# Altium project mcu.PrjPCB
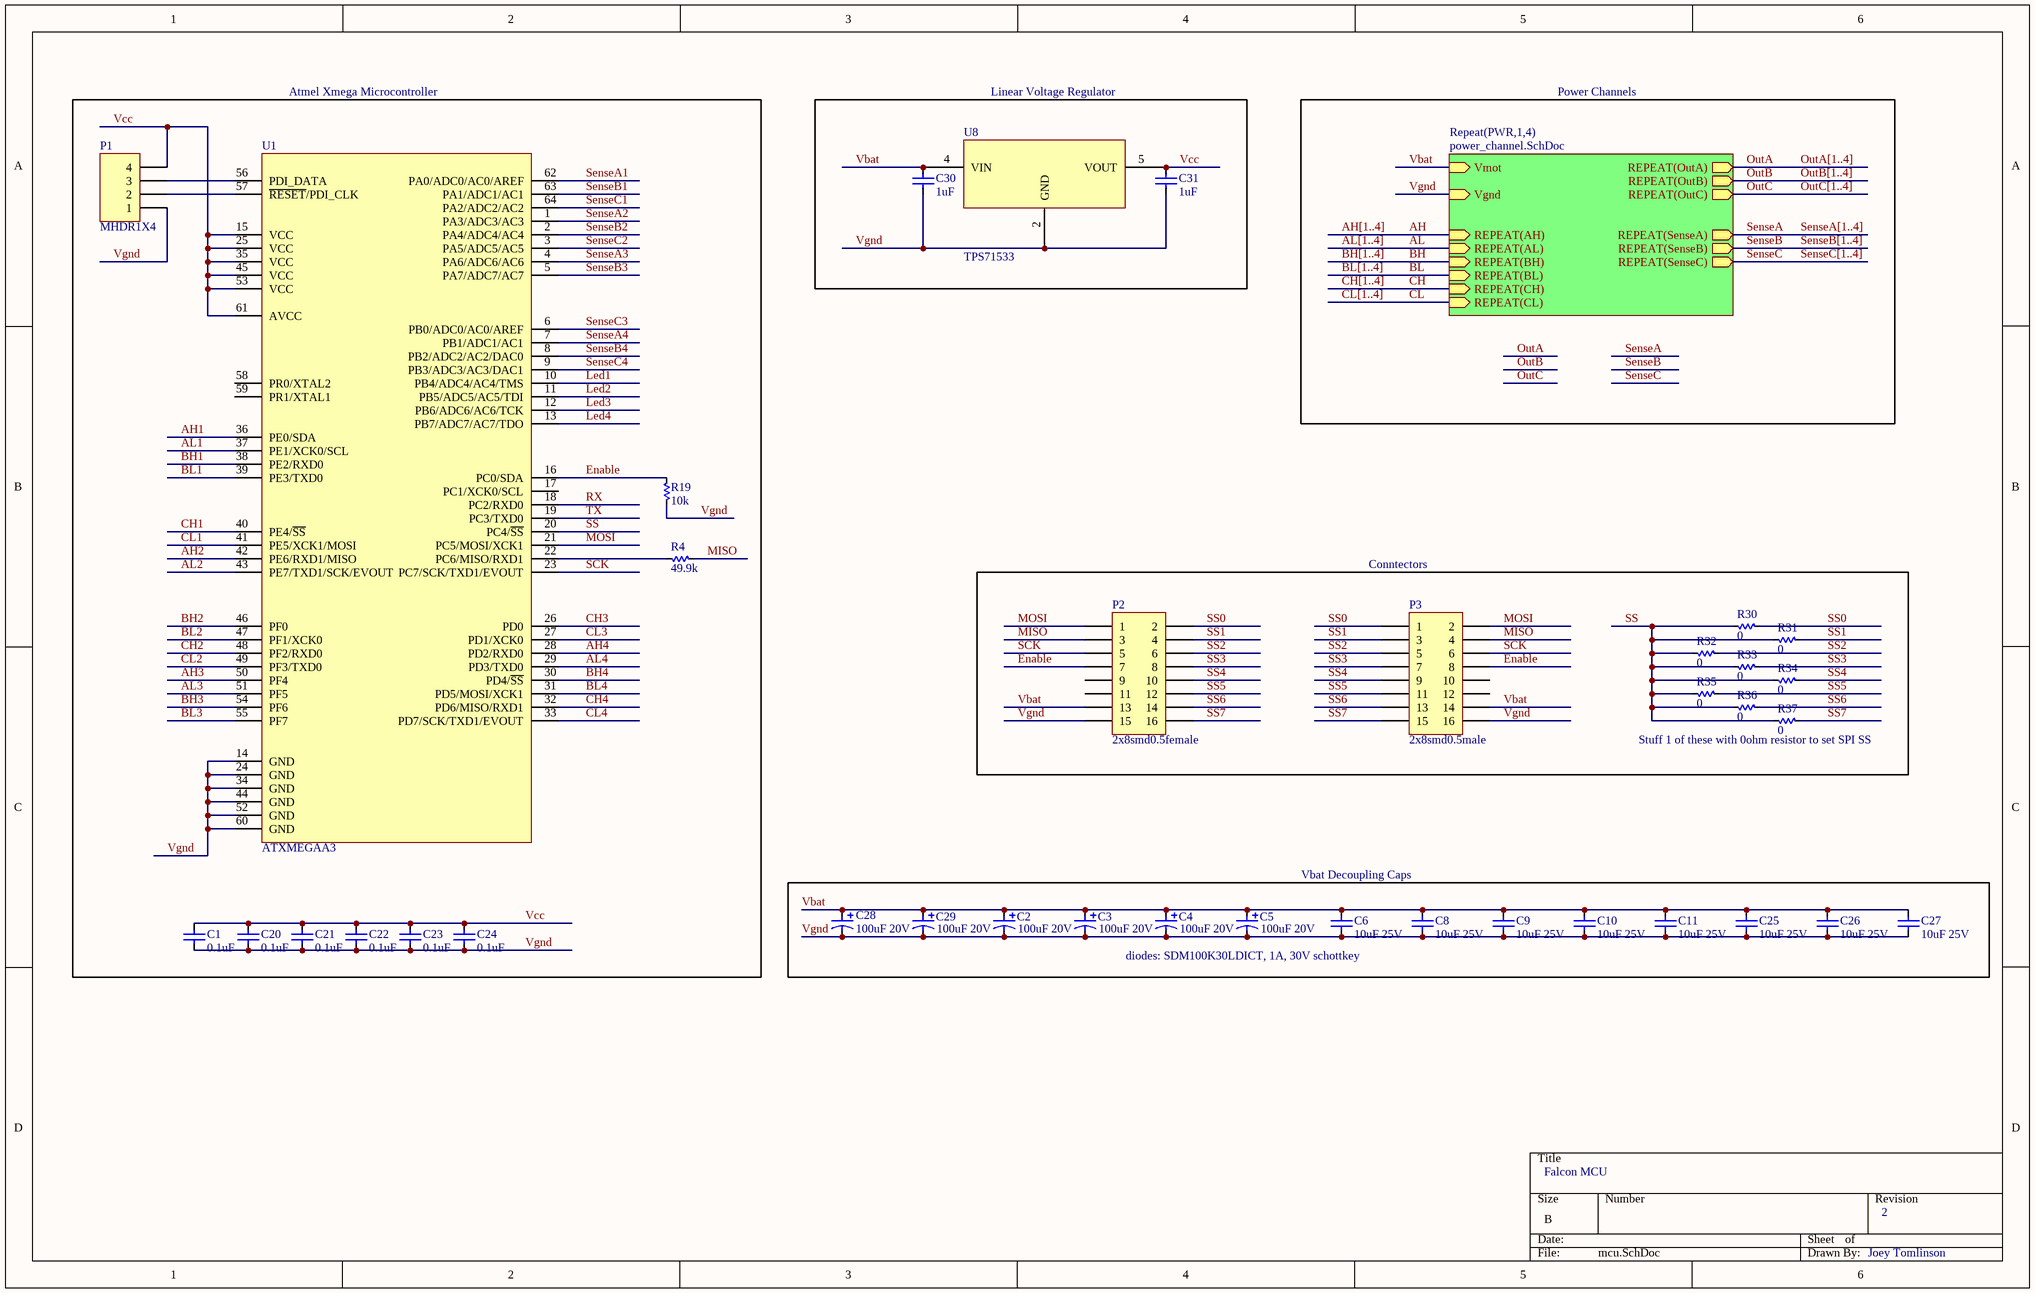
[diagram p0: mcu.SchDoc]
2 sheets, 145 parts. Net scope: hierarchical (ports join the sheet entries above them; power ports are global).
Board file: mcu.PcbDoc
Sheets:
  mcu.SchDoc
    PWR1 = power_channel.SchDoc
    PWR2 = power_channel.SchDoc
    PWR3 = power_channel.SchDoc
    PWR4 = power_channel.SchDoc

## Sheet mcu.SchDoc: Falcon MCU
size B; DrawnBy: Joey Tomlinson; Engineer: Joey Tomlinson; Revision: 2; PageSetup: Record=PageOptions|CenterHorizontal=True|CenterVertical=True|PrintScale=1.54|XCorrection=1.00|YCorrection=1.00|PrintKind=1|BorderSize=5000000|LeftOffset=0|BottomOffset=0|Orientation=2|PaperLength=1000|PaperWidth=1000|Scale=100|PaperSource=7|PrintQuality=-4|MediaType=1|DitherType=10|PaperKind=A2|PrintScaleMode=1

### Parts
C1  value 0.1uF  [0603 (1608)]  (hidden comment: Capacitor)
C2  value 100uF 20V  [7343 (TANT E)]  (hidden comment: Polarized Capacitor)
C3  value 100uF 20V  [7343 (TANT E)]  (hidden comment: Polarized Capacitor)
C4  value 100uF 20V  [7343 (TANT E)]  (hidden comment: Polarized Capacitor)
C5  value 100uF 20V  [7343 (TANT E)]  (hidden comment: Polarized Capacitor)
C6  value 10uF 25V  [0805 (2012)]  (hidden comment: Capacitor)
C8  value 10uF 25V  [0805 (2012)]  (hidden comment: Capacitor)
C9  value 10uF 25V  [0805 (2012)]  (hidden comment: Capacitor)
C10  value 10uF 25V  [0805 (2012)]  (hidden comment: Capacitor)
C11  value 10uF 25V  [0805 (2012)]  (hidden comment: Capacitor)
C20  value 0.1uF  [0603 (1608)]  (hidden comment: Capacitor)
C21  value 0.1uF  [0603 (1608)]  (hidden comment: Capacitor)
C22  value 0.1uF  [0603 (1608)]  (hidden comment: Capacitor)
C23  value 0.1uF  [0603 (1608)]  (hidden comment: Capacitor)
C24  value 0.1uF  [0603 (1608)]  (hidden comment: Capacitor)
C25  value 10uF 25V  [0805 (2012)]  (hidden comment: Capacitor)
C26  value 10uF 25V  [0805 (2012)]  (hidden comment: Capacitor)
C27  value 10uF 25V  [0805 (2012)]  (hidden comment: Capacitor)
C28  value 100uF 20V  [7343 (TANT E)]  (hidden comment: Polarized Capacitor)
C29  value 100uF 20V  [7343 (TANT E)]  (hidden comment: Polarized Capacitor)
C30  value 1uF  [0603 (1608)]  (hidden comment: Capacitor)
C31  value 1uF  [0603 (1608)]  (hidden comment: Capacitor)
P1  MHDR1X4  [MHDR1X4]
P2  2x8smd0.5female  [S9007E-08-ND]
P3  2x8smd0.5male  [S9007E-08-ND]
R4  value 49.9k  [0603 (1608)]  (hidden comment: Resistor)
R19  value 10k  [0603 (1608)]  (hidden comment: Resistor)
R30  value 0  [0603 (1608)]  (hidden comment: Resistor)
R31  value 0  [0603 (1608)]  (hidden comment: Resistor)
R32  value 0  [0603 (1608)]  (hidden comment: Resistor)
R33  value 0  [0603 (1608)]  (hidden comment: Resistor)
R34  value 0  [0603 (1608)]  (hidden comment: Resistor)
R35  value 0  [0603 (1608)]  (hidden comment: Resistor)
R36  value 0  [0603 (1608)]  (hidden comment: Resistor)
R37  value 0  [0603 (1608)]  (hidden comment: Resistor)
U1  ATXMEGAA3  [QFN-64]
U8  TPS71533  [SOT23-5]

### Blocks framed on the sheet
Atmel Xmega Microcontroller: C1 C20-C24 P1 R4 R19 U1
Linear Voltage Regulator: C30 C31 U8

### Sub-sheets
Repeat(PWR,1,4) = power_channel.SchDoc: Vmot (in), REPEAT(AH) (in), REPEAT(AL) (in), REPEAT(BH) (in), REPEAT(BL) (in), REPEAT(CH) (in), REPEAT(CL) (in), REPEAT(OutA) (out), REPEAT(OutB) (out), REPEAT(OutC) (out), REPEAT(SenseA) (out), REPEAT(SenseB) (out), REPEAT(SenseC) (out), Vgnd (in)

### Nets
AH: sheet Repeat(PWR,1,4)/REPEAT(AH)
AH1: U1.36(PE0/SDA)
AH2: U1.42(PE6/RXD1/MISO)
AH3: U1.50(PF4)
AH4: U1.28(PD2/RXD0)
AL: sheet Repeat(PWR,1,4)/REPEAT(AL)
AL1: U1.37(PE1/XCK0/SCL)
AL2: U1.43(PE7/TXD1/SCK/EVOUT)
AL3: U1.51(PF5)
AL4: U1.29(PD3/TXD0)
BH: sheet Repeat(PWR,1,4)/REPEAT(BH)
BH1: U1.38(PE2/RXD0)
BH2: U1.46(PF0)
BH3: U1.54(PF6)
BH4: U1.30(PD4/~{SS})
BL: sheet Repeat(PWR,1,4)/REPEAT(BL)
BL1: U1.39(PE3/TXD0)
BL2: U1.47(PF1/XCK0)
BL3: U1.55(PF7)
BL4: U1.31(PD5/MOSI/XCK1)
CH: sheet Repeat(PWR,1,4)/REPEAT(CH)
CH1: U1.40(PE4/~{SS})
CH2: U1.48(PF2/RXD0)
CH3: U1.26(PD0)
CH4: U1.32(PD6/MISO/RXD1)
CL: sheet Repeat(PWR,1,4)/REPEAT(CL)
CL1: U1.41(PE5/XCK1/MOSI)
CL2: U1.49(PF3/TXD0)
CL3: U1.27(PD1/XCK0)
CL4: U1.33(PD7/SCK/TXD1/EVOUT)
Enable: P2.7 P3.8 R19.2 U1.16(PC0/SDA)
Led1: U1.10(PB4/ADC4/AC4/TMS)
Led2: U1.11(PB5/ADC5/AC5/TDI)
Led3: U1.12(PB6/ADC6/AC6/TCK)
Led4: U1.13(PB7/ADC7/AC7/TDO)
MISO: P2.3 P3.4 R4.1
MOSI: P2.1 P3.2 U1.21(PC5/MOSI/XCK1)
OutA: sheet Repeat(PWR,1,4)/REPEAT(OutA)
OutB: sheet Repeat(PWR,1,4)/REPEAT(OutB)
OutC: sheet Repeat(PWR,1,4)/REPEAT(OutC)
RX: U1.18(PC2/RXD0)
SCK: P2.5 P3.6 U1.23(PC7/SCK/TXD1/EVOUT)
SenseA: sheet Repeat(PWR,1,4)/REPEAT(SenseA)
SenseA1: U1.62(PA0/ADC0/AC0/AREF)  [project net SenseA]
SenseA2: U1.1(PA3/ADC3/AC3)  [project net SenseA]
SenseA3: U1.4(PA6/ADC6/AC6)  [project net SenseA]
SenseA4: U1.7(PB1/ADC1/AC1)  [project net SenseA]
SenseB: sheet Repeat(PWR,1,4)/REPEAT(SenseB)
SenseB1: U1.63(PA1/ADC1/AC1)  [project net SenseB]
SenseB2: U1.2(PA4/ADC4/AC4)  [project net SenseB]
SenseB3: U1.5(PA7/ADC7/AC7)  [project net SenseB]
SenseB4: U1.8(PB2/ADC2/AC2/DAC0)  [project net SenseB]
SenseC: sheet Repeat(PWR,1,4)/REPEAT(SenseC)
SenseC1: U1.64(PA2/ADC2/AC2)  [project net SenseC]
SenseC2: U1.3(PA5/ADC5/AC5)  [project net SenseC]
SenseC3: U1.6(PB0/ADC0/AC0/AREF)  [project net SenseC]
SenseC4: U1.9(PB3/ADC3/AC3/DAC1)  [project net SenseC]
SS: R30.1 R31.1 R32.1 R33.1 R34.1 R35.1 R36.1 R37.1 U1.20(PC4/~{SS})
SS0: P2.2 P3.1 R30.2
SS1: P2.4 P3.3 R31.2
SS2: P2.6 P3.5 R32.2
SS3: P2.8 P3.7 R33.2
SS4: P2.10 P3.9 R34.2
SS5: P2.12 P3.11 R35.2
SS6: P2.14 P3.13 R36.2
SS7: P2.16 P3.15 R37.2
TX: U1.19(PC3/TXD0)
Vbat: C2.1 C3.1 C4.1 C5.1 C6.1 C8.1 C9.1 C10.1 C11.1 C25.1 C26.1 C27.1 C28.1 C29.1 C30.1 P2.13 P3.14 U8.4(VIN) ; sheet Repeat(PWR,1,4)/Vmot
Vcc: C1.1 C20.1 C21.1 C22.1 C23.1 C24.1 C31.1 P1.4 U1.15(VCC) U1.25(VCC) U1.35(VCC) U1.45(VCC) U1.53(VCC) U1.61(AVCC) U8.5(VOUT)
Vgnd: C1.2 C2.2 C3.2 C4.2 C5.2 C6.2 C8.2 C9.2 C10.2 C11.2 C20.2 C21.2 C22.2 C23.2 C24.2 C25.2 C26.2 C27.2 C28.2 C29.2 C30.2 C31.2 P1.1 P2.15 P3.16 R19.1 U1.14(GND) U1.24(GND) U1.34(GND) U1.44(GND) U1.52(GND) U1.60(GND) U8.2(GND) ; sheet Repeat(PWR,1,4)/Vgnd
NetP1_2: P1.2 U1.57(~{RESET}/PDI_CLK)
NetP1_3: P1.3 U1.56(PDI_DATA)
NetR4_2: R4.2 U1.22(PC6/MISO/RXD1)

Not connected (* = marked no-connect by the designer): P2 9 11; P3 10 12; U1 17(PC1/XCK0/SCL) 58(PR0/XTAL2) 59(PR1/XTAL1)

### Buses and harness runs
bus AH[1..4]
bus AL[1..4]
bus BH[1..4]
bus BL[1..4]
bus CH[1..4]
bus CL[1..4]
bus OutA[1..4]
bus OutB[1..4]
bus OutC[1..4]
bus SenseA[1..4]
bus SenseB[1..4]
bus SenseC[1..4]

### Notes on the sheet
- Power Channels
- Conntectors
- (near R37) Stuff 1 of these with 0ohm resistor to set SPI SS
- Vbat Decoupling Caps
- diodes: SDM100K30LDICT, 1A, 30V schottkey

### Library data of the parts
C1 C20-C24 = Capacitor: Part No.: 490-1524-1-ND; Vendor: Digikey; Price Est.: 0.019
C2-C5 C28 C29 = Polarized Capacitor: Part No.: 718-1370-1-ND; Vendor: Digikey
C6 C8-C11 C25-C27 = Capacitor: Part No.: 490-5523-1-ND; Vendor: Digikey; Price Est.: $0.10
C30 C31 = Capacitor: Part No.: 445-3452-1-ND; Vendor: Digikey; Price Est.: 0.061
P1 = MHDR1X4: Header, 4-Pin; Part No.: Not Stuffed; LatestRevisionDate: 17-Jul-2002; LatestRevisionNote: Re-released for DXP Platform.; Publisher: Altium Limited
P2 = 2x8smd0.5female: Vendor: Digikey; Part No.: S9007E-08-ND; Price Est.: 1.43
P3 = 2x8smd0.5male: Part No.: S9013E-08-ND; Vendor: Digikey; Price Est.: 1.43
R4 = Resistor: Part No.: P49.9HCT-ND; Vendor: Digikey; Price Est.: 0.02
R19 = Resistor: Part No.: RMCF0603JT10K0CT-ND; Vendor: Digikey; Price Est.: 0.02
R30-R37 = Resistor: Part No.: RMCF0603ZT0R00CT-ND; Vendor: Digikey; Price Est.: 0.02
U1 = ATXMEGAA3: Manufacturer: Atmel; Part No.: ATXMEGA128A3-MH-ND; Vendor: Digikey; Price Est.: 10.43
U8 = TPS71533: Part No.: 296-12008-1-ND; Vendor: Digikey; Price Est.: 1.29

## Sheet power_channel.SchDoc: Falcon MCU Power Channel
size A; DrawnBy: Joey Tomlinson; Engineer: Joey Tomlinson; Revision: 2
Used 4 times, as channels PWR1, PWR2, PWR3, PWR4. Parts and nets are listed once, with the designators drawn on the sheet.
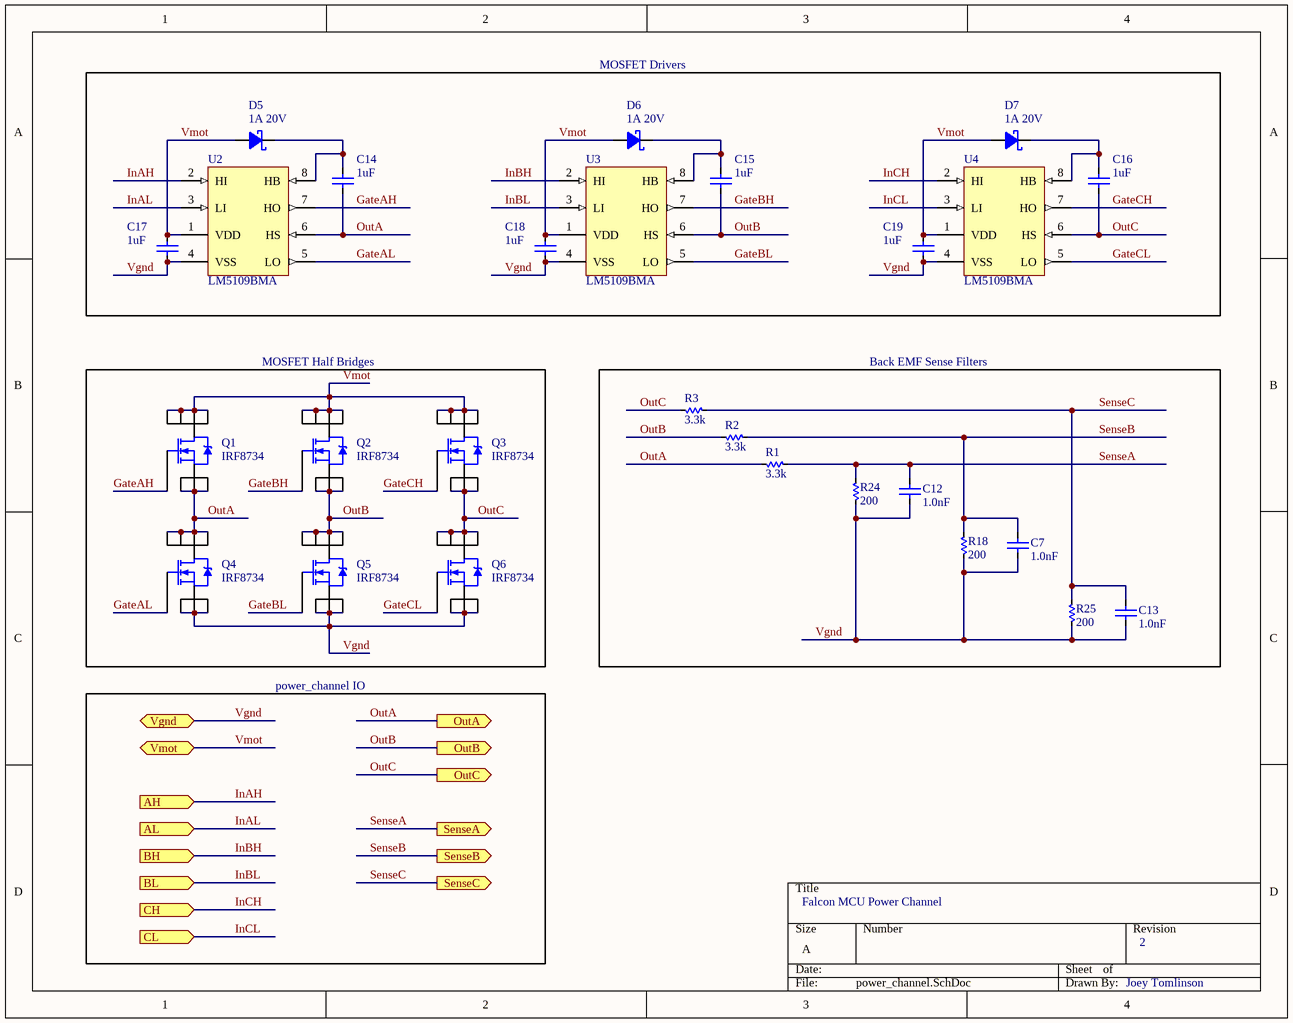
[diagram p1: power_channel.SchDoc]

### Parts
C7  value 1.0nF  [0603 (1608)]  (hidden comment: Capacitor)
C12  value 1.0nF  [0603 (1608)]  (hidden comment: Capacitor)
C13  value 1.0nF  [0603 (1608)]  (hidden comment: Capacitor)
C14  value 1uF  [0603 (1608)]  (hidden comment: Capacitor)
C15  value 1uF  [0603 (1608)]  (hidden comment: Capacitor)
C16  value 1uF  [0603 (1608)]  (hidden comment: Capacitor)
C17  value 1uF  [0603 (1608)]  (hidden comment: Capacitor)
C18  value 1uF  [0603 (1608)]  (hidden comment: Capacitor)
C19  value 1uF  [0603 (1608)]  (hidden comment: Capacitor)
D5  value 1A 20V  [SOD-323]  (hidden comment: Schottky Diode)
D6  value 1A 20V  [SOD-323]  (hidden comment: Schottky Diode)
D7  value 1A 20V  [SOD-323]  (hidden comment: Schottky Diode)
Q1  IRF8734  [SO8]
Q2  IRF8734  [SO8]
Q3  IRF8734  [SO8]
Q4  IRF8734  [SO8]
Q5  IRF8734  [SO8]
Q6  IRF8734  [SO8]
R1  value 3.3k  [0603 (1608)]  (hidden comment: Resistor)
R2  value 3.3k  [0603 (1608)]  (hidden comment: Resistor)
R3  value 3.3k  [0603 (1608)]  (hidden comment: Resistor)
R18  value 200  [0603 (1608)]  (hidden comment: Resistor)
R24  value 200  [0603 (1608)]  (hidden comment: Resistor)
R25  value 200  [0603 (1608)]  (hidden comment: Resistor)
U2  LM5109BMA  [M08A_N]
U3  LM5109BMA  [M08A_N]
U4  LM5109BMA  [M08A_N]

### Blocks framed on the sheet
MOSFET Drivers: C14-C19 D5-D7 U2-U4
MOSFET Half Bridges: Q1-Q6
Back EMF Sense Filters: C7 C12 C13 R1-R3 R18 R24 R25

### Ports
AH (in), AL (in), BH (in), BL (in), CH (in), CL (in), OutA (out), OutB (out), OutC (out), SenseA (out), SenseB (out), SenseC (out), Vgnd, Vmot

### Nets
GateAH: Q1.4(G) U2.7(HO)
GateAL: Q4.4(G) U2.5(LO)
GateBH: Q2.4(G) U3.7(HO)
GateBL: Q5.4(G) U3.5(LO)
GateCH: Q3.4(G) U4.7(HO)
GateCL: Q6.4(G) U4.5(LO)
InAH: U2.2(HI) ; port AH
InAL: U2.3(LI) ; port AL
InBH: U3.2(HI) ; port BH
InBL: U3.3(LI) ; port BL
InCH: U4.2(HI) ; port CH
InCL: U4.3(LI) ; port CL
OutA: C14.2 Q1.1(S) Q1.2(S) Q1.3(S) Q4.5(D) Q4.6(D) Q4.7(D) Q4.8(D) R1.2 U2.6(HS) ; port OutA
OutB: C15.2 Q2.1(S) Q2.2(S) Q2.3(S) Q5.5(D) Q5.6(D) Q5.7(D) Q5.8(D) R2.2 U3.6(HS) ; port OutB
OutC: C16.2 Q3.1(S) Q3.2(S) Q3.3(S) Q6.5(D) Q6.6(D) Q6.7(D) Q6.8(D) R3.2 U4.6(HS) ; port OutC
SenseA: C12.1 R1.1 R24.1 ; port SenseA
SenseB: C7.1 R2.1 R18.1 ; port SenseB
SenseC: C13.1 R3.1 R25.1 ; port SenseC
Vgnd: C7.2 C12.2 C13.2 C17.2 C18.2 C19.2 Q4.1(S) Q4.2(S) Q4.3(S) Q5.1(S) Q5.2(S) Q5.3(S) Q6.1(S) Q6.2(S) Q6.3(S) R18.2 R24.2 R25.2 U2.4(VSS) U3.4(VSS) U4.4(VSS) ; port Vgnd
Vmot: C17.1 C18.1 C19.1 D5.1 D6.1 D7.1 Q1.5(D) Q1.6(D) Q1.7(D) Q1.8(D) Q2.5(D) Q2.6(D) Q2.7(D) Q2.8(D) Q3.5(D) Q3.6(D) Q3.7(D) Q3.8(D) U2.1(VDD) U3.1(VDD) U4.1(VDD) ; port Vmot
NetC14_1: C14.1 D5.2 U2.8(HB)
NetC15_1: C15.1 D6.2 U3.8(HB)
NetC16_1: C16.1 D7.2 U4.8(HB)

### Channels
PWR1: designators end in _PWR1; ports AH=AH1 AL=AL1 BH=BH1 BL=BL1 CH=CH1 CL=CL1 OutA=OutA_PWR1 OutB=OutB_PWR1 OutC=OutC_PWR1 SenseA=SenseA SenseB=SenseB SenseC=SenseC Vgnd=Vgnd Vmot=Vbat
PWR2: designators end in _PWR2; ports AH=AH2 AL=AL2 BH=BH2 BL=BL2 CH=CH2 CL=CL2 OutA=OutA_PWR2 OutB=OutB_PWR2 OutC=OutC_PWR2 SenseA=SenseA SenseB=SenseB SenseC=SenseC Vgnd=Vgnd Vmot=Vbat
PWR3: designators end in _PWR3; ports AH=AH3 AL=AL3 BH=BH3 BL=BL3 CH=CH3 CL=CL3 OutA=OutA_PWR3 OutB=OutB_PWR3 OutC=OutC_PWR3 SenseA=SenseA SenseB=SenseB SenseC=SenseC Vgnd=Vgnd Vmot=Vbat
PWR4: designators end in _PWR4; ports AH=AH4 AL=AL4 BH=BH4 BL=BL4 CH=CH4 CL=CL4 OutA=OutA_PWR4 OutB=OutB_PWR4 OutC=OutC_PWR4 SenseA=SenseA SenseB=SenseB SenseC=SenseC Vgnd=Vgnd Vmot=Vbat

### Notes on the sheet
- power_channel IO

### Library data of the parts
C7 C12 C13 = Capacitor: Part No.: CC0603JRNPO8BN102; Vendor: Digikey; Price Est.: $0.10
C14-C19 = Capacitor: Part No.: 445-3452-1-ND; Vendor: Digikey; Price Est.: 0.061
D5-D7 = Schottky Diode: Part No.: SDM100K30LDICT-ND; Vendor: Digikey; Price Est.: 0.54
Q1-Q6 = IRF8734: Part No.: IRF8734TRPBFCT-ND; Vendor: Digikey; Price Est.: 1.04
R1-R3 = Resistor: Part No.: RMCF0603JT3K30; Vendor: Digikey; Price Est.: 0.02
R18 R24 R25 = Resistor: Part No.: RMCF0603JT200R; Part No. Ref: CRCW[PACKAGE][VALUE]; Vendor: Digikey; Price Est.: 0.02
U2-U4 = LM5109BMA: High Voltage 1A Peak Half Bridge Gate Driver; Manufacturer: National Semiconductor; Part No.: LM5109BMA-ND; CompType: MiscPower; PackageTopMarking: NSZXTT*L5109*BMA; PowerWise: N; Vendor: Digikey; FirstPublished: 4-Dec-2008; DatasheetVersion: Feb-2007; PackageVersion: revL, Sep-2006; PackageReference: M08A; Publisher: Altium Limited; PackageDescription: SOIC Narrow, 4.9 x 3.9 x 1.45mm, 8 Lead, 1.27mm Pitch; PartNumber: LM5109BMA; RoHS: Y; PinCount: 8; DigiKeyPartNumber: LM5109BMA-ND; Code_JEDEC: MS-012-AA; Code_IPC: SOIC127P600-8; ComponentLink1Description: LM5109B Datasheet; ComponentLink1URL: http://www.national.com/ds/LM/LM5109B.pdf; ComponentLink2Description: LM5109B Web Page; ComponentLink2URL: http://www.national.com/pf/LM/LM5109B.html; ComponentLink3Description: M08A Package Page; ComponentLink3URL: http://www.national.com/packaging/folders/m08a.html; Price Est.: 1.70

## Nets that join several sheets
AH1: mcu (U1.36), PWR1 (U2_PWR1.2)
AH2: mcu (U1.42), PWR2 (U2_PWR2.2)
AH3: mcu (U1.50), PWR3 (U2_PWR3.2)
AH4: mcu (U1.28), PWR4 (U2_PWR4.2)
AL1: mcu (U1.37), PWR1 (U2_PWR1.3)
AL2: mcu (U1.43), PWR2 (U2_PWR2.3)
AL3: mcu (U1.51), PWR3 (U2_PWR3.3)
AL4: mcu (U1.29), PWR4 (U2_PWR4.3)
BH1: mcu (U1.38), PWR1 (U3_PWR1.2)
BH2: mcu (U1.46), PWR2 (U3_PWR2.2)
BH3: mcu (U1.54), PWR3 (U3_PWR3.2)
BH4: mcu (U1.30), PWR4 (U3_PWR4.2)
BL1: mcu (U1.39), PWR1 (U3_PWR1.3)
BL2: mcu (U1.47), PWR2 (U3_PWR2.3)
BL3: mcu (U1.55), PWR3 (U3_PWR3.3)
BL4: mcu (U1.31), PWR4 (U3_PWR4.3)
CH1: mcu (U1.40), PWR1 (U4_PWR1.2)
CH2: mcu (U1.48), PWR2 (U4_PWR2.2)
CH3: mcu (U1.26), PWR3 (U4_PWR3.2)
CH4: mcu (U1.32), PWR4 (U4_PWR4.2)
CL1: mcu (U1.41), PWR1 (U4_PWR1.3)
CL2: mcu (U1.49), PWR2 (U4_PWR2.3)
CL3: mcu (U1.27), PWR3 (U4_PWR3.3)
CL4: mcu (U1.33), PWR4 (U4_PWR4.3)
SenseA: mcu (U1.4), PWR3 (C12_PWR3.1 R1_PWR3.1 R24_PWR3.1)
SenseA: mcu (U1.7), PWR4 (C12_PWR4.1 R1_PWR4.1 R24_PWR4.1)
SenseA: mcu (U1.62), PWR1 (C12_PWR1.1 R1_PWR1.1 R24_PWR1.1)
SenseA: mcu (U1.1), PWR2 (C12_PWR2.1 R1_PWR2.1 R24_PWR2.1)
SenseB: mcu (U1.5), PWR3 (C7_PWR3.1 R2_PWR3.1 R18_PWR3.1)
SenseB: mcu (U1.8), PWR4 (C7_PWR4.1 R2_PWR4.1 R18_PWR4.1)
SenseB: mcu (U1.63), PWR1 (C7_PWR1.1 R2_PWR1.1 R18_PWR1.1)
SenseB: mcu (U1.2), PWR2 (C7_PWR2.1 R2_PWR2.1 R18_PWR2.1)
SenseC: mcu (U1.3), PWR2 (C13_PWR2.1 R3_PWR2.1 R25_PWR2.1)
SenseC: mcu (U1.6), PWR3 (C13_PWR3.1 R3_PWR3.1 R25_PWR3.1)
SenseC: mcu (U1.9), PWR4 (C13_PWR4.1 R3_PWR4.1 R25_PWR4.1)
SenseC: mcu (U1.64), PWR1 (C13_PWR1.1 R3_PWR1.1 R25_PWR1.1)
Vbat: mcu (18 pins), PWR1 (21 pins), PWR2 (21 pins), PWR3 (21 pins), PWR4 (21 pins)
Vgnd: mcu (33 pins), PWR1 (21 pins), PWR2 (21 pins), PWR3 (21 pins), PWR4 (21 pins)